# Altium schematic sheet [6] High Voltage.SchDoc
size A4
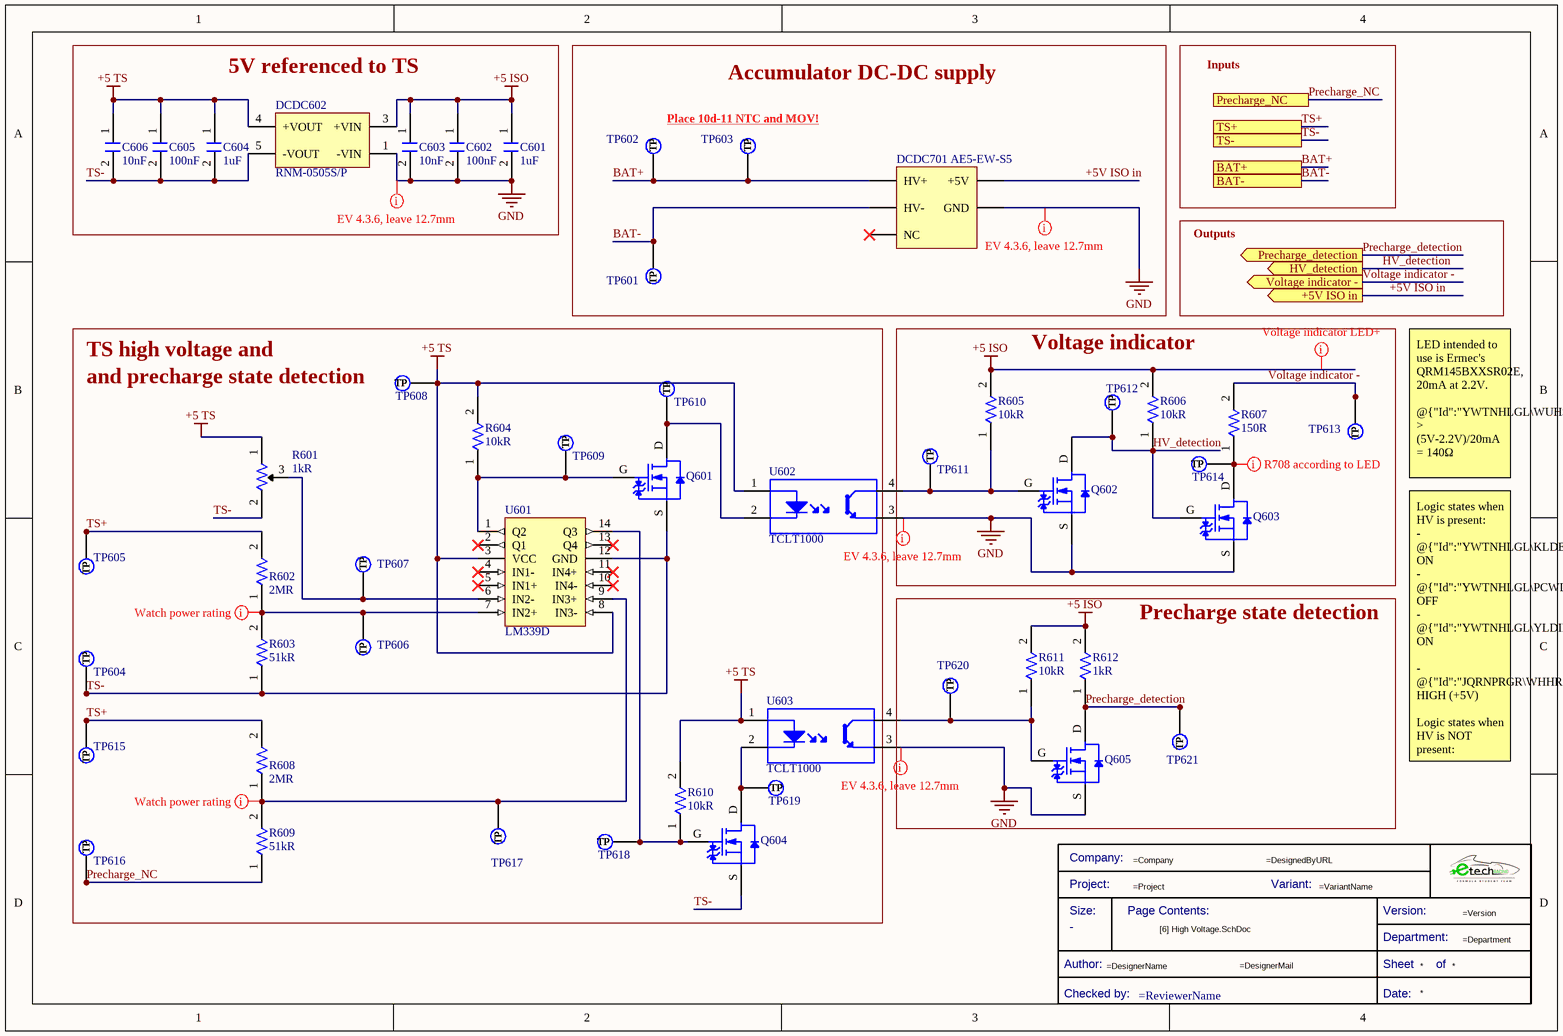
[diagram p0: [6] High Voltage.SchDoc]

## Parts
*  Title Block_template  (value not drawn)  (graphical)
C601  Capacitance: 1uF  [C0805FNPC-R]  (hidden comment: 885012207103)
C602  Capacitance: 100nF  [C0805FNPC-R]  (hidden comment: 885012207098)
C603  Capacitance: 10nF  [C0805FNPC-R]  (hidden comment: 885012207092)
C604  Capacitance: 1uF  [C0805FNPC-R]  (hidden comment: 885012207103)
C605  Capacitance: 100nF  [C0805FNPC-R]  (hidden comment: 885012207098)
C606  Capacitance: 10nF  [C0805FNPC-R]  (hidden comment: 885012207092)
DCDC602  RNM-0505S/P  [DCDC_RNM-0505S/P]
DCDC701  AE5-EW-S5  [DCDC_1000-5_ISO]
Q601  CPH3455-TL-H  [TRT-NCH-3/35-CPH]  (value not drawn)
Q602  CPH3455-TL-H  [TRT-NCH-3/35-CPH]  (value not drawn)
Q603  CPH3455-TL-H  [TRT-NCH-3/35-CPH]  (value not drawn)
Q604  CPH3455-TL-H  [TRT-NCH-3/35-CPH]  (value not drawn)
Q605  CPH3455-TL-H  [TRT-NCH-3/35-CPH]  (value not drawn)
R601  Resistance: 1kR  [R1k-VTR]  (hidden comment: 3296Y-1-102LF)
R602  Resistence: 2MR  [R1206FTK-W]  (hidden comment: HVC1206-2M0FT3)
R603  Resistance: 51kR  [R1206FTK-W]  (hidden comment: CRCW120610K0FKEA)
R604  Resistance: 10kR  [R0805FTK]  (hidden comment: CR0805-JW-103ELF)
R605  Resistance: 10kR  [R0805FTK]  (hidden comment: CR0805-JW-103ELF)
R606  Resistance: 10kR  [R0805FTK]  (hidden comment: CR0805-JW-103ELF)
R607  Resistance: 150R  [R1206FTK-W]  (hidden comment: CRG1206F150R)
R608  Resistence: 2MR  [R1206FTK-W]  (hidden comment: HVC1206-2M0FT3)
R609  Resistance: 51kR  [R1206FTK-W]  (hidden comment: CRCW120610K0FKEA)
R610  Resistance: 10kR  [R0805FTK]  (hidden comment: CR0805-JW-103ELF)
R611  Resistance: 10kR  [R0805FTK]  (hidden comment: CR0805-JW-103ELF)
R612  Resistance: 1kR  [R0805FTK]  (hidden comment: CR0805-JW-102ELF)
TP601  TestPoint  [TestPoint]  (value not drawn)  (no BOM)
TP602  TestPoint  [TestPoint]  (value not drawn)  (no BOM)
TP603  TestPoint  [TestPoint]  (value not drawn)  (no BOM)
TP604  TestPoint  [TestPoint]  (value not drawn)  (no BOM)
TP605  TestPoint  [TestPoint]  (value not drawn)  (no BOM)
TP606  TestPoint  [TestPoint]  (value not drawn)  (no BOM)
TP607  TestPoint  [TestPoint]  (value not drawn)  (no BOM)
TP608  TestPoint  [TestPoint]  (value not drawn)  (no BOM)
TP609  TestPoint  [TestPoint]  (value not drawn)  (no BOM)
TP610  TestPoint  [TestPoint]  (value not drawn)  (no BOM)
TP611  TestPoint  [TestPoint]  (value not drawn)  (no BOM)
TP612  TestPoint  [TestPoint]  (value not drawn)  (no BOM)
TP613  TestPoint  [TestPoint]  (value not drawn)  (no BOM)
TP614  TestPoint  [TestPoint]  (value not drawn)  (no BOM)
TP615  TestPoint  [TestPoint]  (value not drawn)  (no BOM)
TP616  TestPoint  [TestPoint]  (value not drawn)  (no BOM)
TP617  TestPoint  [TestPoint]  (value not drawn)  (no BOM)
TP618  TestPoint  [TestPoint]  (value not drawn)  (no BOM)
TP619  TestPoint  [TestPoint]  (value not drawn)  (no BOM)
TP620  TestPoint  [TestPoint]  (value not drawn)  (no BOM)
TP621  TestPoint  [TestPoint]  (value not drawn)  (no BOM)
U601  LM339D  [Array_4_Amp_LM339D]
U602  Supplier Part Number 1: TCLT1000  [Optocoupler_TCLT1000]  (hidden comment: Optocoupler_TCLT1000)
U603  Supplier Part Number 1: TCLT1000  [Optocoupler_TCLT1000]  (hidden comment: Optocoupler_TCLT1000)

## Blocks framed on the sheet
5V referenced to TS: C601-C606 DCDC602
Accumulator DC-DC supply: DCDC701 TP601-TP603
Voltage indicator: Q602 Q603 R605-R607 TP611-TP614
Precharge state detection: Q605 R611 R612 TP620 TP621

## Ports
+5V ISO in (out), BAT+, BAT-, HV_detection (out), Precharge_detection (out), Precharge_NC, TS+, TS-, Voltage indicator - (out)

## Nets
+5 ISO: C601.1 C602.1 C603.1 DCDC602.3(+VIN) R605.2 R606.2 R611.2 R612.2
+5 TS: C604.1 C605.1 C606.1 DCDC602.4(+VOUT) R601.1 R604.2 R610.2 TP608.1(TP) U601.3(VCC) U601.8(IN3-) U602.1(A) U603.1(A)
GND: C601.2 C602.2 C603.2 DCDC602.1(-VIN) DCDC701.5(GND) Q602.S Q603.S Q605.S U602.3(C) U603.3(C)
+5V ISO in: DCDC701.4(+5V) ; port +5V ISO in
BAT+: DCDC701.3(HV+) TP602.1(TP) TP603.1(TP) ; port BAT+
BAT-: DCDC701.2(HV-) TP601.1(TP) ; port BAT-
HV_detection: Q602.D Q603.G R606.1 TP612.1(TP) ; port HV_detection
Precharge_detection: Q605.D R612.1 TP621.1(TP) ; port Precharge_detection
Precharge_NC: R609.1 TP616.1(TP) ; port Precharge_NC
TS+: R602.2 R608.2 TP605.1(TP) TP615.1(TP) ; port TS+
TS-: C604.2 C605.2 C606.2 DCDC602.5(-VOUT) Q601.S Q604.S R601.2 R603.1 TP604.1(TP) U601.12(GND) ; port TS-
Voltage indicator -: R607.2 TP613.1(TP) ; port Voltage indicator -
NetQ601_D: Q601.D TP610.1(TP) U602.2(K)
NetQ601_G: Q601.G R604.1 TP609.1(TP) U601.1(Q2)
NetQ602_G: Q602.G R605.1 TP611.1(TP) U602.4(E)
NetQ603_D: Q603.D R607.1 TP614.1(TP)
NetQ604_D: Q604.D TP619.1(TP) U603.2(K)
NetQ604_G: Q604.G R610.1 TP618.1(TP) U601.14(Q3)
NetQ605_G: Q605.G R611.1 TP620.1(TP) U603.4(E)
NetR601_3: R601.3 TP607.1(TP) U601.6(IN2-)
NetR602_1: R602.1 R603.2 TP606.1(TP) U601.7(IN2+)
NetR608_1: R608.1 R609.2 TP617.1(TP) U601.9(IN3+)

Not connected (* = marked no-connect by the designer): DCDC701 1(NC)*; U601 2(Q1)* 4(IN1-)* 5(IN1+)* 10(IN4-)* 11(IN4+)* 13(Q4)*

## Layout directives
mark named Watch power rating: NetR602_1, NetR608_1
mark named Voltage indicator LED+: +5 ISO
mark named R708 according to LED: NetQ603_D
mark named EV 4.3.6, leave 12.7mm: GND

## Notes on the sheet
- Inputs
- Place 10d-11 NTC and MOV!
- Outputs
- TS high voltage and
- (near TP608) and precharge state detection
- LED intended to use is Ermec's QRM145BXXSR02E, 20mA at 2.2V.
  @{"Id":"YWTNHLGL\WUHSQKVY"} > (5V-2.2V)/20mA = 140Ω
- Logic states when HV is present:
  - @{"Id":"YWTNHLGL\KLDEZGNF"} ON
  - @{"Id":"YWTNHLGL\PCWLGYRZ"} OFF
  - @{"Id":"YWTNHLGL\YLDILRFA"} ON
  - @{"Id":"JQRNPRGR\WHHROFCI"} HIGH (+5V)
  Logic states when HV is NOT present:
  - @{"Id":"YWTNHLGL\KLDEZGNF"} OFF
  - @{"Id":"YWTNHLGL\PCWLGYRZ"} ON
  - @{"Id":"YWTNHLGL\YLDILRFA"} OFF
  - @{"Id":"JQRNPRGR\WHHROFCI"} LOW(0V)
- (in symbol Title Block_template) Company:; Project:; Variant:; Size:; Page Contents:; Version:; Department:; Author:; Sheet; of; Checked by:; Date:

## Library data of the parts
* = Title Block_template: Standard Title Block; Category: Title Block; Checked by:: =ReviewerName; Size: -
C601 C604 = C1u-50V-0805FNPC-X7R: Multilayer Ceramic Capacitor, Wcap-Csgp Series, 1 F, 10%, X7R, 50 V, 0805 [2012 Metric] Rohs Compliant: Yes; Manufacturer 1: Wurth Electronics; Voltage Rating: 50V; .Creator: GP; Supplier 1: RSComponents; Manufacturer Part Number 1: 885012207103; RoHS: Yes; Category: Ceramic Capacitors; Stock 1: 5100; Pricing 1: 50=0,27200, 250=0,25300, 500=0,22800, 1250=0,20100, 2500=0,17100 (GBP); Mount: Surface Mount; Case/Package: 0805; Case Code (Metric): 2012; Case Code (Imperial): 0805; Min Operating Temperature: -55°C; Max Operating Temperature: 85°C; Packaging: Cut Tape; Dielectric: X7R; Tolerance: 10%; Voltage Rating (DC): 50V; Length: 0.079inch; Width: 0.049inch; Thickness: 0.053inch; REACH SVHC: Unknown; RoHS Compliant: Yes; ComponentLink1URL: http://www.farnell.com/datasheets/1958501.pdf?src-supplier=Farnell; ComponentLink1Description: http://www.farnell.com/datasheets/1958501.pdf?src-supplier=Farnell; ComponentLink2URL: http://www.farnell.com/datasheets/1958501.pdf?src-supplier=Element14; ComponentLink2Description: http://www.farnell.com/datasheets/1958501.pdf?src-supplier=Element14; ComponentLink3URL: https://katalog.we-online.de/pbs/datasheet/885012107003.pdf?src-supplier=Digi-Key; ComponentLink3Description: https://katalog.we-online.de/pbs/datasheet/885012107003.pdf?src-supplier=Digi-Key; ComponentLink4URL: http://www.farnell.com/datasheets/1958501.pdf?src-supplier=Newark; ComponentLink4Description: http://www.farnell.com/datasheets/1958501.pdf?src-supplier=Newark; Supplier Part Number 1: 1813523
C602 C605 = C100n-50V-0805FNPC-X7R: Cap, 0.1ΜF, 50V, 10%, X7R, 0805; Manufacturer 1: Wurth Electronics; .Creator: DR; Supplier 1: RSComponents; Manufacturer Part Number 1: 885012207098; RoHS: Yes; Category: Ceramic Capacitors; Stock 1: 8000; Pricing 1: 100=0,10200, 500=0,07100, 2000=0,06100 (GBP); Mount: Surface Mount; Case/Package: 0805; Case Code (Metric): 2012; Case Code (Imperial): 0805; Min Operating Temperature: -55°C; Max Operating Temperature: 125°C; Packaging: Cut Tape; Voltage Rating: 50V; Dielectric: X7R; Tolerance: 10%; Voltage Rating (DC): 50V; Length: 0.079inch; Width: 0.049inch; Thickness: 0.035inch; REACH SVHC: Unknown; RoHS Compliant: Yes; ComponentLink1URL: http://www.farnell.com/datasheets/1958498.pdf?src-supplier=Farnell; ComponentLink1Description: http://www.farnell.com/datasheets/1958498.pdf?src-supplier=Farnell; ComponentLink2URL: http://www.farnell.com/datasheets/1958498.pdf?src-supplier=Element14; ComponentLink2Description: http://www.farnell.com/datasheets/1958498.pdf?src-supplier=Element14; ComponentLink3URL: https://katalog.we-online.de/pbs/datasheet/885012207098.pdf?src-supplier=Digi-Key; ComponentLink3Description: https://katalog.we-online.de/pbs/datasheet/885012207098.pdf?src-supplier=Digi-Key; ComponentLink4URL: http://www.farnell.com/datasheets/1958498.pdf?src-supplier=Newark; ComponentLink4Description: http://www.farnell.com/datasheets/1958498.pdf?src-supplier=Newark; Supplier Part Number 1: 1813493
C603 C606 = C10n-50V-0805FNPC-X7R: Cap, 0.01ΜF, 50V, 10%, X7R, 0805; Manufacturer 1: Wurth Electronics; .Creator: DR; Supplier 1: RSComponents; Manufacturer Part Number 1: 885012207092; RoHS: Yes; Category: Ceramic Capacitors; Stock 1: 1; Pricing 1: 4000=0,03200, 12000=0,03100 (USD); Mount: Surface Mount; Case/Package: 0805; Case Code (Metric): 2012; Case Code (Imperial): 0805; Min Operating Temperature: -55°C; Max Operating Temperature: 125°C; Packaging: Cut Tape; Voltage Rating: 50V; Dielectric: X7R; Tolerance: 10%; Voltage Rating (DC): 50V; Length: 0.079inch; Width: 0.049inch; Thickness: 0.035inch; REACH SVHC: Unknown; RoHS Compliant: Yes; ComponentLink1URL: http://www.farnell.com/datasheets/1958497.pdf?src-supplier=Farnell; ComponentLink1Description: http://www.farnell.com/datasheets/1958497.pdf?src-supplier=Farnell; ComponentLink2URL: http://www.farnell.com/datasheets/1958497.pdf?src-supplier=Element14; ComponentLink2Description: http://www.farnell.com/datasheets/1958497.pdf?src-supplier=Element14; ComponentLink3URL: http://www.farnell.com/datasheets/1958497.pdf?src-supplier=Newark; ComponentLink3Description: http://www.farnell.com/datasheets/1958497.pdf?src-supplier=Newark; ComponentLink4URL: https://katalog.we-online.de/pbs/datasheet/885012207092.pdf?src-supplier=Digi-Key; ComponentLink4Description: https://katalog.we-online.de/pbs/datasheet/885012207092.pdf?src-supplier=Digi-Key; Supplier Part Number 1: 1813941
DCDC602 = DCDC_RNM-0505S/P: 1W DC/DC-Converter 'ECONOLINE' DIP6 1kV unreg; V. In: 05; V. Out: 05; mA. Out: 200; Manufacturer: Recom; Min Input Voltage: 4.5V; Number of Outputs: 1; Voltage - Output 1: 5V; Max Input Voltage: 5.5V; Max Output Current: 200mA; Efficiency: 78%; Isolation: Isolated; .Creator: GP; ComponentLink1Description: Where buy it; ComponentLink1URL: https://recom-power.com/en/products/dc-dc-converters/rec-p-RNM-0505S!sP.html?0; Supplier 1: Digi-Key; RoHS: Yes; Category: Voltage Regulators - Switching; Pricing 1: 1=8,32000, 5=8,20400, 10=8,08600, 25=7,84840, 50=7,61040, 100=7,37260, 250=7,13476, 440=6,65909 (USD); Mount: Through Hole; Case/Package: DIP; Number of Pins: 4; Weight: 1.1g; Min Operating Temperature: -40°C; Max Operating Temperature: 85°C; Output Power: 1W; Packaging: Rail/Tube; Isolation Voltage: 1kV; Package Quantity: 60; Nominal Input Voltage: 5V; Max Power Dissipation: 1W; Max Output Voltage: 5V; Features: SCP; Series: ECONOLINE RNM; Output Current: 200mA; Output Voltage: 5V; Max Output Power: 1W; Current - Output 1: 200mA; Min Input Voltage (DC): 4.5V; Max Input Voltage (DC): 5.5V; Length: 8.3mm; Width: 8.3mm; Height: 6.8mm; Depth: 8.3mm; Lead Free: Lead Free; RoHS Compliant: Yes; ComponentLink2URL: https://datasheet.ciiva.com/2172/rnm-2172491.pdf?src-supplier=Digi-Key; ComponentLink2Description: https://datasheet.ciiva.com/2172/rnm-2172491.pdf?src-supplier=Digi-Key; Supplier Part Number 1: 945-2307-5-ND; Manufacturer Part Number: RNM-0505S/P
DCDC701 = DCDC-ISO-1000V/5V-1A: dc-dc isolated, 5 W, 100~1000 Vdc input, 5V, 1 A, DIP, ext temp; Manufacturer 1: CUI; .Creator: DR; ComponentLink1URL: https://www.mouser.es/datasheet/2/670/ae5_ew-1774237.pdf; ComponentLink1Description: Datasheet; ComponentLink2Description: Where buy it; ComponentLink2URL: https://www.mouser.es/ProductDetail/CUI-Inc/AE5-EW-S5?qs=f9yNj16SXrJNGSJA82%2F47g%3D%3D; Supplier 1: Digi-Key; RoHS: Yes; Category: Board Mount Modules; Stock 1: 12; Pricing 1: 1=50,11000, 5=49,72000 (USD); RoHS Compliant: No; Supplier Part Number 1: 102-4489-ND; Manufacturer Part Number 1: AE5-EW-S5
Q601-Q605 = TRT-NCH-3/35-CPH: CPH3455-TL-H N-channel MOSFET Transistor; 3 A; 35 V; 3-Pin CPH; Manufacturer: ON Semiconductor; Rds On Max: 104mR; Input Capacitance: 186pF; Rise Time: 4.7ns; Drain to Source Voltage (Vdss): 35V; Continuous Drain Current (ID): 3A; Max Power Dissipation: 1W; Drain to Source Resistance: 108mR; Turn-On Delay Time: 4.2ns; Turn-Off Delay Time: 15ns; Fall Time: 5.7ns; Element Configuration: Single; Gate to Source Voltage (Vgs): 20V; .Creator: GP; Category: Transistor; ComponentLink1Description: Datasheet; ComponentLink1URL: https://docs.rs-online.com/5847/0900766b812d514d.pdf; ComponentLink2Description: Where buy it; ComponentLink2URL: https://es.rs-online.com/web/p/mosfet/8009989; Supplier 1: RSComponents; Manufacturer Part Number: CPH3455-TL-H; RoHS: Yes; Stock 1: 1; Pricing 1: 50=0,50400 (USD); Case/Package: SC; Number of Pins: 3; Min Operating Temperature: -55°C; Max Operating Temperature: 150°C; Package Quantity: 3000; Packaging: Tape and Reel; Drain to Source Breakdown Voltage: 35V; Power Dissipation: 1W; Polarity: N-CHANNEL; Series: -; Length: 2.9mm; Width: 1.6mm; Height: 0.9mm; Lead Free: Lead Free; Halogen Free: Halogen Free; RoHS Compliant: Yes; ComponentLink3URL: https://datasheet.ciiva.com/947/cph3455-d-947201.pdf?src-supplier=Digi-Key; ComponentLink3Description: https://datasheet.ciiva.com/947/cph3455-d-947201.pdf?src-supplier=Digi-Key; ComponentLink4URL: https://datasheet.ciiva.com/4444/cph3455-d-91653-4444616.pdf?src-supplier=Mouser; ComponentLink4Description: https://datasheet.ciiva.com/4444/cph3455-d-91653-4444616.pdf?src-supplier=Mouser; ComponentLink5URL: https://datasheet.ciiva.com/11164/cph3455-d-11164889.pdf?src-supplier=Avnet; ComponentLink5Description: https://datasheet.ciiva.com/11164/cph3455-d-11164889.pdf?src-supplier=Avnet; Supplier Part Number 1: 8009989
R601 = R1k-VTR: Res Cermet Trimmer 1K Ohm 10% 1/2W 25(Elec)Turn 2.19mm (9.53 X 4.83 X 11.55mm) Pin Thru-Hole Tube; Manufacturer: Bourns; Power Rating: 500mW; Number of Turns: 25; Temperature Coefficient: 100ppm/°C; .Creator: DO; Supplier 1: RSComponents; Manufacturer Part Number: 3296Y-1-102LF; RoHS: Yes; Category: Variable Resistors and Potentiometers; Stock 1: 230; Pricing 1: 1=3,12300, 10=2,81500, 25=2,56000, 50=2,35900, 100=1,87600 (USD); Mount: Through Hole,Panel,PCB; Weight: 0.03oz; Color: Blue; Contact Plating: Tin,Matte; Min Operating Temperature: -55°C; Max Operating Temperature: 125°C; Tolerance: 10%; Packaging: Rail/Tube; Package Quantity: 50; Resistor Type: Cermet; Termination: Pin; Taper: Linear; Max Power Dissipation: 500mW; Series: 3296; Technology: CERMET; Resistance Tolerance: 10%; Length: 9.53mm; Width: 9.53mm; Height: 0.395inch; Depth: 4.83mm; Radiation Hardening: No; REACH SVHC: No SVHC; Military Standard: Not; Lead Free: Lead Free; RoHS Compliant: Yes; ComponentLink1URL: https://datasheet.ciiva.com/19482/1156947-19482160.pdf?src-supplier=Jameco; ComponentLink1Description: https://datasheet.ciiva.com/19482/1156947-19482160.pdf?src-supplier=Jameco; ComponentLink2URL: https://datasheet.ciiva.com/11832/0900766b8069ccf4-11832263.pdf?src-supplier=RSComponents; ComponentLink2Description: https://datasheet.ciiva.com/11832/0900766b8069ccf4-11832263.pdf?src-supplier=RSComponents; ComponentLink3URL: https://datasheet.ciiva.com/29122/447301-da-01-en-trimmer-tht3296y-1-102lf-1k-0-5w-29122384.pdf?src-supplier=Conrad; ComponentLink3Description: https://datasheet.ciiva.com/29122/447301-da-01-en-trimmer-tht3296y-1-102lf-1k-0-5w-29122384.pdf?src-supplier=Conrad; ComponentLink4URL: https://datasheet.ciiva.com/14173/dabourns3296-data-e-14173007.pdf?src-supplier=Distrelec; ComponentLink4Description: https://datasheet.ciiva.com/14173/dabourns3296-data-e-14173007.pdf?src-supplier=Distrelec; ComponentLink5URL: https://datasheet.ciiva.com/3267/3296-3267278.pdf?src-supplier=Avnet; ComponentLink5Description: https://datasheet.ciiva.com/3267/3296-3267278.pdf?src-supplier=Avnet; ComponentLink6URL: https://datasheet.ciiva.com/15156/getdatasheetpartid-88201-15156460.pdf?src-supplier=Verical; ComponentLink6Description: https://datasheet.ciiva.com/15156/getdatasheetpartid-88201-15156460.pdf?src-supplier=Verical; ComponentLink7URL: https://datasheet.ciiva.com/25907/3296-25907272.pdf?src-supplier=Avnet+Europe; ComponentLink7Description: https://datasheet.ciiva.com/25907/3296-25907272.pdf?src-supplier=Avnet+Europe; ComponentLink8URL: https://datasheet.ciiva.com/2156/3296-2156899.pdf?src-supplier=Digi-Key; ComponentLink8Description: https://datasheet.ciiva.com/2156/3296-2156899.pdf?src-supplier=Digi-Key; ComponentLink9URL: https://datasheet.ciiva.com/16714/70153578-16714745.pdf?src-supplier=Allied+Electronics; ComponentLink9Description: https://datasheet.ciiva.com/16714/70153578-16714745.pdf?src-supplier=Allied+Electronics; ComponentLink10URL: https://datasheet.ciiva.com/1131/1815117-1131446.pdf?src-supplier=Element14; ComponentLink10Description: https://datasheet.ciiva.com/1131/1815117-1131446.pdf?src-supplier=Element14; Supplier 2: Arrow Electronics; Stock 2: 438; Pricing 2: 1=1,46410 (USD)
R602 R608 = R2M-1206FTK: Res Thick Film 1206 2M Ohm 1% 0.3W ±100ppm/C Pad SMD T/R; Manufacturer: TT Welwyn; Power Rating: 300mW; Voltage Rating: 1kV; Temperature Coefficient: 100ppm/°C; .Creator: DO; ComponentLink1Description: Datasheet; ComponentLink1URL: https://www.murata.com/en-eu/api/pdfdownloadapi?cate=cgsubHighVoltageResistors&partno=MHR0307SA205G20; Supplier 1: Future Electronics; Manufacturer Part Number: HVC1206-2M0FT3; RoHS: Yes; Category: Uncategorized; Pricing 1: 3000=1,11000 (USD); Case Code (Metric): 3216; Case Code (Imperial): 1206; Resistance: 2MR; Tolerance: 1%; Packaging: Cut Tape; Resistor Type: Thick Film; Voltage Rating (DC): 1kV; REACH SVHC: No SVHC; RoHS Compliant: Yes; ComponentLink2URL: https://datasheet.ciiva.com/28677/1720556-28677405.pdf?src-supplier=Element14; ComponentLink2Description: https://datasheet.ciiva.com/28677/1720556-28677405.pdf?src-supplier=Element14; Supplier Part Number 1: 6119491
R603 R609 = R51k-1206FTK: Res Thick Film 1206 51K Ohm 1% 1/4W ±100ppm/°C Molded SMD SMD Punched Carrier T/R; Manufacturer: Panasonic; Manufacturer Part Number: ERJ-S08F5102V; Power Rating: 250mW; Voltage Rating: 150V; Voltage Rating (DC): 200V; Current Rating: 2A; .Creator: DO; Category: Resistor; ComponentLink1Description: Datasheet; ComponentLink1URL: https://docs.rs-online.com/bca8/A700000006404581.pdf; ComponentLink2Description: Where buy it; ComponentLink2URL: https://es.rs-online.com/web/p/resistencias-de-montaje-en-superficie/6791765; Supplier 1: Mouser; RoHS: Yes; Stock 1: 4091; Pricing 1: 1=0,31000, 10=0,26700, 50=0,26700, 100=0,10700, 1000=0,05100, 10000=0,03400 (USD); Mount: Surface Mount; Case/Package: 1206; Case Code (Metric): 3216; Case Code (Imperial): 1206; Contact Plating: Tin; Min Operating Temperature: -55°C; Max Operating Temperature: 155°C; Packaging: Tape and Reel; Tolerance: 1%; Package Quantity: 5000; Resistor Type: Thick Film; Number of Terminations: 2; Temperature Coefficient: 100ppm/°C; Max Power Dissipation: 250mW; Features: Anti-Sulfur; Series: ERJ; Construction: Rectangular; Length: 3.2mm; Width: 0.063inch; Height: 0.028inch; Depth: 1.6mm; Military Standard: Not; Lead Free: Lead Free; RoHS Compliant: Yes; ComponentLink3URL: https://datasheet.ciiva.com/24023/aoa0000ce5-24023518.pdf?src-supplier=Mouser; ComponentLink3Description: https://datasheet.ciiva.com/24023/aoa0000ce5-24023518.pdf?src-supplier=Mouser; ComponentLink4URL: https://datasheet.ciiva.com/9189/aoa0000ce5-9189211.pdf?src-supplier=Avnet; ComponentLink4Description: https://datasheet.ciiva.com/9189/aoa0000ce5-9189211.pdf?src-supplier=Avnet; Supplier Part Number 1: 667-ERJ-S08F5102V
R604-R606 R610 R611 = R10k-0805FTK: BOURNS         CR0805-JW-103ELF            Surface Mount Chip Resistor, Thick Film, CR Series, 10 kohm, 125 mW,  5%, 150 V; Temperature Coefficient: 200ppm/°C; Power Rating: 125mW; Voltage Rating: 150V; Voltage Rating (DC): 100V; .Creator: DR; Supplier 1: Arrow Electronics; Manufacturer 1: Bourns; Manufacturer Part Number 1: CR0805-JW-103ELF; RoHS: Yes; Category: Chip SMD Resistors; Stock 1: 57566; Pricing 1: 1=0,05790, 10=0,01540, 25=0,01340, 100=0,00340 (USD); Mount: Surface Mount; Case/Package: 0805; Number of Pins: 2; Contact Plating: Tin; Case Code (Metric): 2012; Case Code (Imperial): 0805; Min Operating Temperature: -55°C; Max Operating Temperature: 155°C; Tolerance: 5%; Resistor Type: Thick Film; Package Quantity: 1; Packaging: Tape and Reel; Number of Terminations: 2; Termination: SMD/SMT; Max Power Dissipation: 125mW; Features: Moisture Resistant; Series: CR0805; Construction: Rectangular; Resistance Tolerance: 5%; Technology: THICK FILM; Length: 2mm; Width: 1.25mm; Height: 0.5mm; Depth: 1.25mm; Thickness: 508um; Radiation Hardening: No; REACH SVHC: No SVHC; Military Standard: Not; RoHS Compliant: Yes; ComponentLink1URL: https://datasheet.ciiva.com/11821/0900766b80fcdb72-11821135.pdf?src-supplier=RSComponents; ComponentLink1Description: https://datasheet.ciiva.com/11821/0900766b80fcdb72-11821135.pdf?src-supplier=RSComponents; ComponentLink2URL: https://datasheet.ciiva.com/9122/chpreztr-9122374.pdf?src-supplier=Avnet; ComponentLink2Description: https://datasheet.ciiva.com/9122/chpreztr-9122374.pdf?src-supplier=Avnet; ComponentLink3URL: https://datasheet.ciiva.com/22693/1902866-22693254.pdf?src-supplier=Element14; ComponentLink3Description: https://datasheet.ciiva.com/22693/1902866-22693254.pdf?src-supplier=Element14; ComponentLink4URL: https://datasheet.ciiva.com/7986/691949-7986187.pdf?src-supplier=Element14; ComponentLink4Description: https://datasheet.ciiva.com/7986/691949-7986187.pdf?src-supplier=Element14; ComponentLink5URL: https://datasheet.ciiva.com/30065/159chpreztr-30065976.pdf?src-supplier=Onlinecomponents.com; ComponentLink5Description: https://datasheet.ciiva.com/30065/159chpreztr-30065976.pdf?src-supplier=Onlinecomponents.com; ComponentLink6URL: https://datasheet.ciiva.com/16783/70154685-16783482.pdf?src-supplier=Allied+Electronics; ComponentLink6Description: https://datasheet.ciiva.com/16783/70154685-16783482.pdf?src-supplier=Allied+Electronics; ComponentLink7URL: https://datasheet.ciiva.com/5548/chpreztr-5548491.pdf?src-supplier=Mouser; ComponentLink7Description: https://datasheet.ciiva.com/5548/chpreztr-5548491.pdf?src-supplier=Mouser; ComponentLink8URL: https://datasheet.ciiva.com/6559/chpreztr-6559900.pdf?src-supplier=Digi-Key; ComponentLink8Description: https://datasheet.ciiva.com/6559/chpreztr-6559900.pdf?src-supplier=Digi-Key; ComponentLink9URL: https://datasheet.ciiva.com/6559/chpreztr-6559901.pdf?src-supplier=Digi-Key; ComponentLink9Description: https://datasheet.ciiva.com/6559/chpreztr-6559901.pdf?src-supplier=Digi-Key; ComponentLink10URL: https://datasheet.ciiva.com/7985/1856384-7985869.pdf?src-supplier=Element14; ComponentLink10Description: https://datasheet.ciiva.com/7985/1856384-7985869.pdf?src-supplier=Element14; ComponentLink11URL: https://datasheet.ciiva.com/48692/001055517-da-01-en-smd-wid-cr0805-jw-103elf-10k-ohm-1-8w-48692118.pdf?src-supplier=Conrad; ComponentLink11Description: https://datasheet.ciiva.com/48692/001055517-da-01-en-smd-wid-cr0805-jw-103elf-10k-ohm-1-8w-48692118.pdf?src-supplier=Conrad; Supplier Part Number 1: CR0805-JW-103ELF
R607 = R150-1206FTK: Res Thick Film 1206 150 Ohm 1% 0.25W(1/4W) ±100ppm/C Pad SMD T/R; Manufacturer: TE Connectivity; Temperature Coefficient: 100ppm/°C; Max Power Dissipation: 250mW; Voltage Rating: 200V; Number of Resistors: 1; .Creator: GP; Category: Resistor; ComponentLink1Description: Datasheet; ComponentLink1URL: https://docs.rs-online.com/5dac/0900766b813e2406.pdf; ComponentLink2Description: Where buy it; ComponentLink2URL: https://es.rs-online.com/web/p/resistencias-de-montaje-en-superficie/2232142; Supplier 1: RSComponents; Manufacturer Part Number: CRG1206F150R; RoHS: Yes; Stock 1: 1; Pricing 1: 50=0,05500, 500=0,05100, 1000=0,04600, 2000=0,04100, 4000=0,03600 (USD); Mount: Surface Mount; Case/Package: 1206; Case Code (Imperial): 1206; Case Code (Metric): 3216; Weight: 0.000571oz; Min Operating Temperature: -55°C; Max Operating Temperature: 125°C; Tolerance: 1%; Packaging: Tape and Reel; Resistor Type: Thick Film; Package Quantity: 5000; Number of Terminations: 2; Series: CRG, Neohm; Power Rating: 250mW; Termination: Solder; Technology: THICK FILM; Length: 3.1mm; Width: 1.55mm; Height: 0.55mm; Depth: 1.55mm; RoHS Compliant: Yes; ELV: Compliant; Supplier Part Number 1: 2232142
R612 = R1k-0805FTK: Res Thick Film 0805 1K Ohm 5% 1/8W ±200ppm/°C Molded SMD SMD Paper Tape on Plastic Reel; Manufacturer 1: Bourns; Voltage Rating (DC): 150V; Power Rating: 125mW; .Creator: GP; Supplier 1: Arrow Electronics; Manufacturer Part Number 1: CR0805-JW-102ELF; RoHS: Yes; Category: Chip SMD Resistors; Stock 1: 27510; Pricing 1: 1=0,05930, 10=0,03510, 25=0,01790, 100=0,00800, 250=0,00790, 500=0,00590, 1000=0,00360, 3000=0,00350, 6000=0,00250 (USD); Mount: Surface Mount; Case/Package: 0805; Number of Pins: 2; Contact Plating: Tin; Case Code (Metric): 2012; Case Code (Imperial): 0805; Min Operating Temperature: -55°C; Max Operating Temperature: 155°C; Resistor Type: Thick Film; Tolerance: 5%; Temperature Coefficient: 200ppm/°C; Features: Moisture Resistant; Package Quantity: 1; Packaging: Tape and Reel; Voltage Rating: 150V; Number of Terminations: 2; Termination: SMD/SMT; Max Power Dissipation: 125mW; Length: 2mm; Width: 1.25mm; Height: 0.5mm; Thickness: 508um; Depth: 1.25mm; Radiation Hardening: No; Lead Free: Lead Free; REACH SVHC: No SVHC; Military Standard: Not; ComponentLink1URL: https://datasheet.ciiva.com/11821/0900766b80fcdb72-11821134.pdf?src-supplier=RSComponents; ComponentLink1Description: https://datasheet.ciiva.com/11821/0900766b80fcdb72-11821134.pdf?src-supplier=RSComponents; ComponentLink2URL: https://datasheet.ciiva.com/15225/getdatasheetpartid-78155-15225381.pdf?src-supplier=Verical; ComponentLink2Description: https://datasheet.ciiva.com/15225/getdatasheetpartid-78155-15225381.pdf?src-supplier=Verical; ComponentLink3URL: https://datasheet.ciiva.com/22693/1902866-22693253.pdf?src-supplier=Element14; ComponentLink3Description: https://datasheet.ciiva.com/22693/1902866-22693253.pdf?src-supplier=Element14; ComponentLink4URL: https://datasheet.ciiva.com/7986/1856384-7986184.pdf?src-supplier=Element14; ComponentLink4Description: https://datasheet.ciiva.com/7986/1856384-7986184.pdf?src-supplier=Element14; ComponentLink5URL: https://datasheet.ciiva.com/7985/1856384-7985867.pdf?src-supplier=Element14; ComponentLink5Description: https://datasheet.ciiva.com/7985/1856384-7985867.pdf?src-supplier=Element14; ComponentLink6URL: https://datasheet.ciiva.com/30242/159chpreztr-30242765.pdf?src-supplier=Onlinecomponents.com; ComponentLink6Description: https://datasheet.ciiva.com/30242/159chpreztr-30242765.pdf?src-supplier=Onlinecomponents.com; ComponentLink7URL: https://datasheet.ciiva.com/6547/chpreztr-6547359.pdf?src-supplier=Digi-Key; ComponentLink7Description: https://datasheet.ciiva.com/6547/chpreztr-6547359.pdf?src-supplier=Digi-Key; Supplier Part Number 1: CR0805-JW-102ELF
TP601-TP621 = TestPoint: Test Point 1x1 mm; .Creator: GP; Category: TestPoint; .PCBcheck: GP; .SCHcheck: GP
U601 = Array_4_Amp_LM339D: Comparator Quad ±18V/36V 14-Pin SOIC Tube; Manufacturer: Texas Instruments; Number of Channels: 4; Nominal Supply Current: 2mA; Output Current: 20mA; Quiescent Current: 2.5mA; Max Supply Voltage: 30V; Min Supply Voltage: 2V; Min Dual Supply Voltage: 1V; Max Dual Supply Voltage: 15V; Voltage Gain: 106.02dB; Max Supply Current: 500uA; Input Bias Current: 250nA; Output Current per Channel: 6mA; Input Offset Voltage (Vos): 5mV; Response Time: 0.3us; Output Type: TTL; Dual Supply Voltage: 9V; .Creator: DO; Supplier 1: Digi-Key; RoHS: Yes; Category: Amplifiers - Op Amps, Buffer, Instrumentation; Stock 1: 10834; Pricing 1: 1=0,93000, 10=0,83500, 25=0,79240, 100=0,65090, 250=0,60848, 500=0,53774, 1000=0,46725 (USD); Mount: Surface Mount; Case/Package: SOIC; Number of Pins: 14; Contact Plating: Gold; Weight: 0.004318oz; Min Operating Temperature: 0°C; Max Operating Temperature: 70°C; Packaging: Rail/Tube; Package Quantity: 50; Number of Elements: 4; Supply Current: 2mA; Technology: BIPOLAR; Max Input Current: 250nA; Series: LM339; Length: 8.65mm; Width: 3.91mm; Height: 1.58mm; Radiation Hardening: No; REACH SVHC: No SVHC; Lead Free: Lead Free; RoHS Compliant: Yes; ComponentLink1URL: https://datasheet.ciiva.com/15131/getdatasheetpartid-248452-15131099.pdf?src-supplier=Verical; ComponentLink1Description: https://datasheet.ciiva.com/15131/getdatasheetpartid-248452-15131099.pdf?src-supplier=Verical; ComponentLink2URL: https://datasheet.ciiva.com/1483/1831045-1483000.pdf?src-supplier=Element14; ComponentLink2Description: https://datasheet.ciiva.com/1483/1831045-1483000.pdf?src-supplier=Element14; ComponentLink3URL: https://datasheet.ciiva.com/1827/lm139a-1827534.pdf?src-supplier=Digi-Key; ComponentLink3Description: https://datasheet.ciiva.com/1827/lm139a-1827534.pdf?src-supplier=Digi-Key; ComponentLink4URL: https://datasheet.ciiva.com/2970/lm2901-2970484.pdf?src-supplier=Avnet; ComponentLink4Description: https://datasheet.ciiva.com/2970/lm2901-2970484.pdf?src-supplier=Avnet; ComponentLink5URL: https://datasheet.ciiva.com/48712/001010753-da-01-en-ic-quad-diff-comp-lm339d-soic-14-tid-48712470.pdf?src-supplier=Conrad; ComponentLink5Description: https://datasheet.ciiva.com/48712/001010753-da-01-en-ic-quad-diff-comp-lm339d-soic-14-tid-48712470.pdf?src-supplier=Conrad; Supplier Part Number 1: 296-1013-5-ND; ComponentLink6Description: Where buy it; ComponentLink6URL: https://es.rs-online.com/web/p/comparadores/0858411; Manufacturer Part Number: LM339D
U602 U603 = Optocoupler_TCLT1000: Optocoupler DC-IN 1-CH Transistor DC-OUT 4-Pin SOP T/R; Manufacturer: Vishay Semiconductors; Number of Channels: 1; Collector Emitter Voltage (VCEO): 70V; Reverse Breakdown Voltage: 6V; Forward Voltage: 1.6V; Forward Current: 60mA; Max Power Dissipation: 250mW; Rise Time: 3s; Output Current per Channel: 50mA; Collector Emitter Saturation Voltage: 300mV; Isolation Voltage: 5kV; Fall Time: 4.7s; Current Transfer Ratio: 600%; Approvals: UL; Supplier 1: Arrow Electronics; Manufacturer Part Number: TCLT1000; RoHS: Yes; Category: Optocouplers; Stock 1: 9000; Pricing 1: 3000=0,24220, 6000=0,23440 (USD); Mount: Surface Mount,PCB; Case/Package: SOP; Number of Pins: 4; Min Operating Temperature: -40°C; Max Operating Temperature: 100°C; Package Quantity: 1; Packaging: Tape and Reel; Output Voltage: 70V; Max Output Voltage: 70V; Max Collector Current: 50mA; Number of Elements: 1; Power Dissipation: 250mW; Max Input Current: 60mA; Collector Emitter Breakdown Voltage: 70V; Input Current: 50mA; Voltage Rating (DC): 70V; Radiation Hardening: No; REACH SVHC: Unknown; Lead Free: Lead Free; RoHS Compliant: Yes; ComponentLink1URL: https://datasheet.ciiva.com/11771/0900766b80e30925-11771693.pdf?src-supplier=RSComponents; ComponentLink1Description: https://datasheet.ciiva.com/11771/0900766b80e30925-11771693.pdf?src-supplier=RSComponents; ComponentLink2URL: https://datasheet.ciiva.com/8040/52022-8040864.pdf?src-supplier=Element14; ComponentLink2Description: https://datasheet.ciiva.com/8040/52022-8040864.pdf?src-supplier=Element14; ComponentLink3URL: https://datasheet.ciiva.com/15118/getdatasheetpartid-145514-15118804.pdf?src-supplier=Verical; ComponentLink3Description: https://datasheet.ciiva.com/15118/getdatasheetpartid-145514-15118804.pdf?src-supplier=Verical; ComponentLink4URL: https://datasheet.ciiva.com/26321/tclt1000-26321177.pdf?src-supplier=Element14; ComponentLink4Description: https://datasheet.ciiva.com/26321/tclt1000-26321177.pdf?src-supplier=Element14; ComponentLink5URL: https://datasheet.ciiva.com/5783/tclt1000-5783658.pdf?src-supplier=Farnell; ComponentLink5Description: https://datasheet.ciiva.com/5783/tclt1000-5783658.pdf?src-supplier=Farnell; ComponentLink6URL: https://datasheet.ciiva.com/8091/tclt1000-8091688.pdf?src-supplier=Avnet; ComponentLink6Description: https://datasheet.ciiva.com/8091/tclt1000-8091688.pdf?src-supplier=Avnet; ComponentLink7URL: https://datasheet.ciiva.com/16493/tclt1000-16493446.pdf?src-supplier=Future+Electronics; ComponentLink7Description: https://datasheet.ciiva.com/16493/tclt1000-16493446.pdf?src-supplier=Future+Electronics